# Altium schematic sheet 限行提醒器.SchDoc
size A4
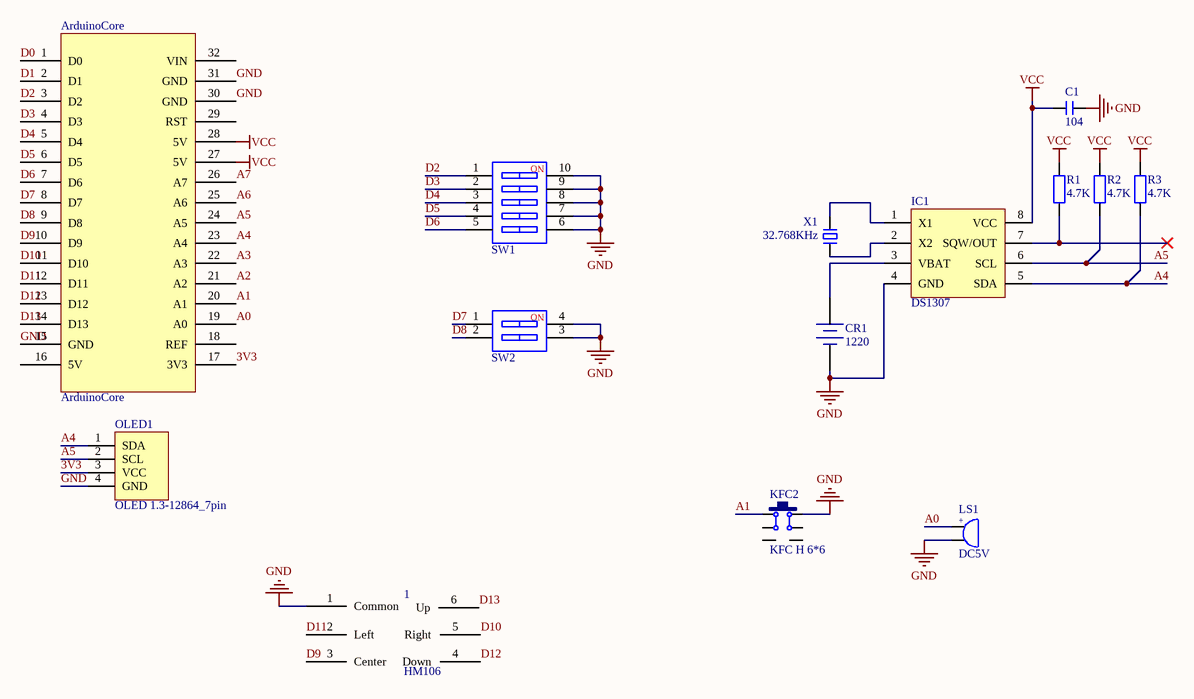
[diagram p0: 限行提醒器.SchDoc]

## Parts
1  HM106  [WX SMD-10*10*10]
ArduinoCore  ArduinoCore  [ArduinoCore]
C1  104  [C 0805]
CR1  1220  [CR1220_B]
IC1  DS1307  [SOP8_M]
KFC2  KFC H 6*6  [KFC DIP-6*6*8_V]
LS1  DC5V  [BUZZER-7525]
OLED1  OLED 1.3-12864_7pin  [OLED 0.91-12832_4pin]
R1  4.7K  [R 0805]
R2  4.7K  [R 0805]
R3  4.7K  [R 0805]
SW1  CSW-5P  [CSW DIP-5P]  (value not drawn)
SW2  CSW-2P  [CSW DIP-2P_G]  (value not drawn)
X1  32.768KHz  [XTAL-3215]

## Nets
GND: 1.1(Common) ArduinoCore.15(GND) ArduinoCore.30(GND) ArduinoCore.31(GND) C1.1 CR1.2(DC-) IC1.4(GND) KFC2.4 LS1.2 OLED1.4(GND) SW1.6 SW1.7 SW1.8 SW1.9 SW1.10 SW2.3 SW2.4
VCC: ArduinoCore.27(5V) ArduinoCore.28(5V) C1.2 IC1.8(VCC) R1.2 R2.2 R3.2
3V3: ArduinoCore.17(3V3) OLED1.3(VCC)
A0: ArduinoCore.19(A0) LS1.1
A1: ArduinoCore.20(A1) KFC2.3
A2: ArduinoCore.21(A2)
A3: ArduinoCore.22(A3)
A4: ArduinoCore.23(A4) IC1.5(SDA) OLED1.1(SDA) R3.1
A5: ArduinoCore.24(A5) IC1.6(SCL) OLED1.2(SCL) R2.1
A6: ArduinoCore.25(A6)
A7: ArduinoCore.26(A7)
D0: ArduinoCore.1(D0)
D1: ArduinoCore.2(D1)
D2: ArduinoCore.3(D2) SW1.1
D3: ArduinoCore.4(D3) SW1.2
D4: ArduinoCore.5(D4) SW1.3
D5: ArduinoCore.6(D5) SW1.4
D6: ArduinoCore.7(D6) SW1.5
D7: ArduinoCore.8(D7) SW2.1
D8: ArduinoCore.9(D8) SW2.2
D9: 1.3(Center) ArduinoCore.10(D9)
D10: 1.5(Right) ArduinoCore.11(D10)
D11: 1.2(Left) ArduinoCore.12(D11)
D12: 1.4(Down) ArduinoCore.13(D12)
D13: 1.6(Up) ArduinoCore.14(D13)
NetCR1_1: CR1.1(DC+) IC1.3(VBAT)
NetIC1_1: IC1.1(X1) X1.2
NetIC1_2: IC1.2(X2) X1.1
NetIC1_7: IC1.7(SQW/OUT) R1.1

Not connected (* = marked no-connect by the designer): ArduinoCore 16(5V) 18(REF) 29(RST) 32(VIN); KFC2 1 2 5 6

## Notes on the sheet
- (in symbol BEEP) +
- (in symbol CSW-2P) NO
- (in symbol CSW-5P) NO

## Library data of the parts
C1 = C: 无极性贴片电容; 版权归属: 源创客; BOM名称: 无极性贴片电容; 学习资源: www.ooocke.com
CR1 = CR-3V: 微型电池; 版权归属: 源创客; BOM名称: 微型电池; 学习资源: www.ooocke.com
IC1 = DS1307: 1307实时时钟芯片; BOM名称: 实时时钟芯片; 版权归属: 源创客; 学习资源: www.ooocke.com
KFC2 = KFC H 6*6: 6x6横置自锁开关
LS1 = BEEP: 蜂鸣器; 版权归属: 源创客; BOM名称: 蜂鸣器; 学习资源: www.ooocke.com
OLED1 = OLED 0.91_IIC_4pin: 12832 点阵屏; BOM名称: 12864 点阵屏; 版权归属: 源创客; 学习资源: www.ooocke.com
R1-R3 = R: 贴片电阻; 版权归属: 源创客; BOM名称: 贴片电阻; 学习资源: www.ooocke.com
SW1 = CSW-5P: 5路编码开关; 版权归属: 源创客; BOM名称: 5路编码开关; 学习资源: www.ooocke.com
SW2 = CSW-2P: 2路编码开关; 版权归属: 源创客; BOM名称: 2路编码开关; 学习资源: www.ooocke.com
X1 = XTAL-2: 2脚晶振; 版权归属: 源创客; BOM名称: 2脚晶振; 学习资源: www.ooocke.com